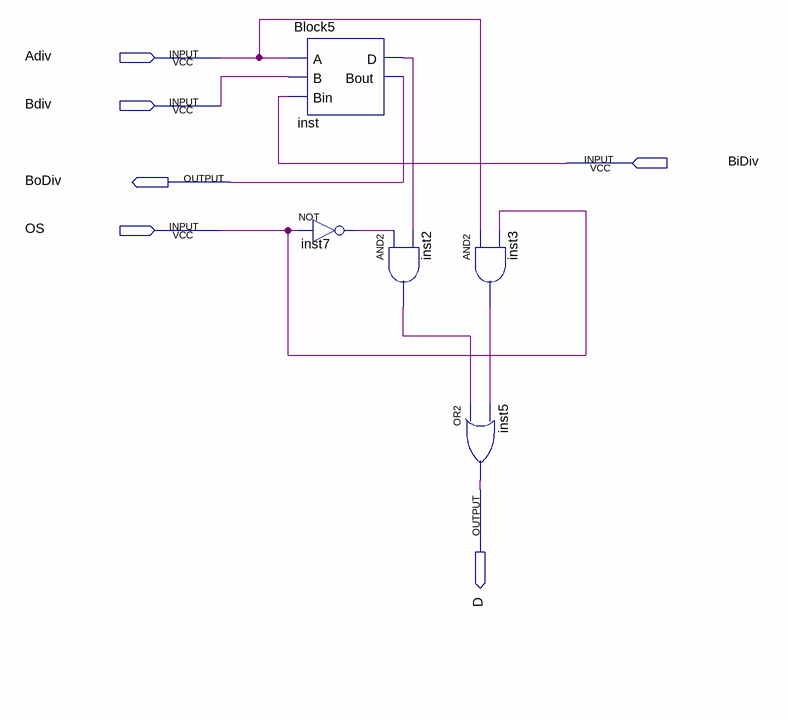
[diagram p0: schematic sheet]
// Quartus schematic Block2.bdf as structural Verilog: 5 symbols, 6 pins
module Block2 (
  input  Adiv,
  input  Bdiv,
  input  BiDiv,
  input  OS,
  output BoDiv,
  output D
);

  wire inst2_out, inst3_out, inst7_out, inst_d;

  Block5 inst (.A(Adiv), .B(Bdiv), .Bin(BiDiv), .D(inst_d), .Bout(BoDiv));
  not inst7 (inst7_out, OS);
  and inst2 (inst2_out, inst7_out, inst_d);
  and inst3 (inst3_out, Adiv, OS);
  or inst5 (D, inst2_out, inst3_out);
endmodule
